# Altium project SDR_LAPAC.PrjPcb (part 4 of 4)

## Sheet AD9364_RF.SchDoc: AD9364_RF
size A3; DrawnBy: Omar_Lopez; Engineer: Omar_Lopez; DocumentNumber: 6; SheetNumber: 6; SheetTotal: 7; PageSetup: Record=PageOptions|CenterHorizontal=True|CenterVertical=True|PrintScale=0.51|XCorrection=1.00|YCorrection=1.00|PrintKind=1|BorderSize=5000000|LeftOffset=0|BottomOffset=0|Orientation=2|PaperLength=1000|PaperWidth=1000|Scale=100|PaperSource=7|PrintQuality=-3|MediaType=1|DitherType=10|PrintScaleMode=1|PaperKind=A3|PaperIndex=8; ModifiedDate: 17/08/2018
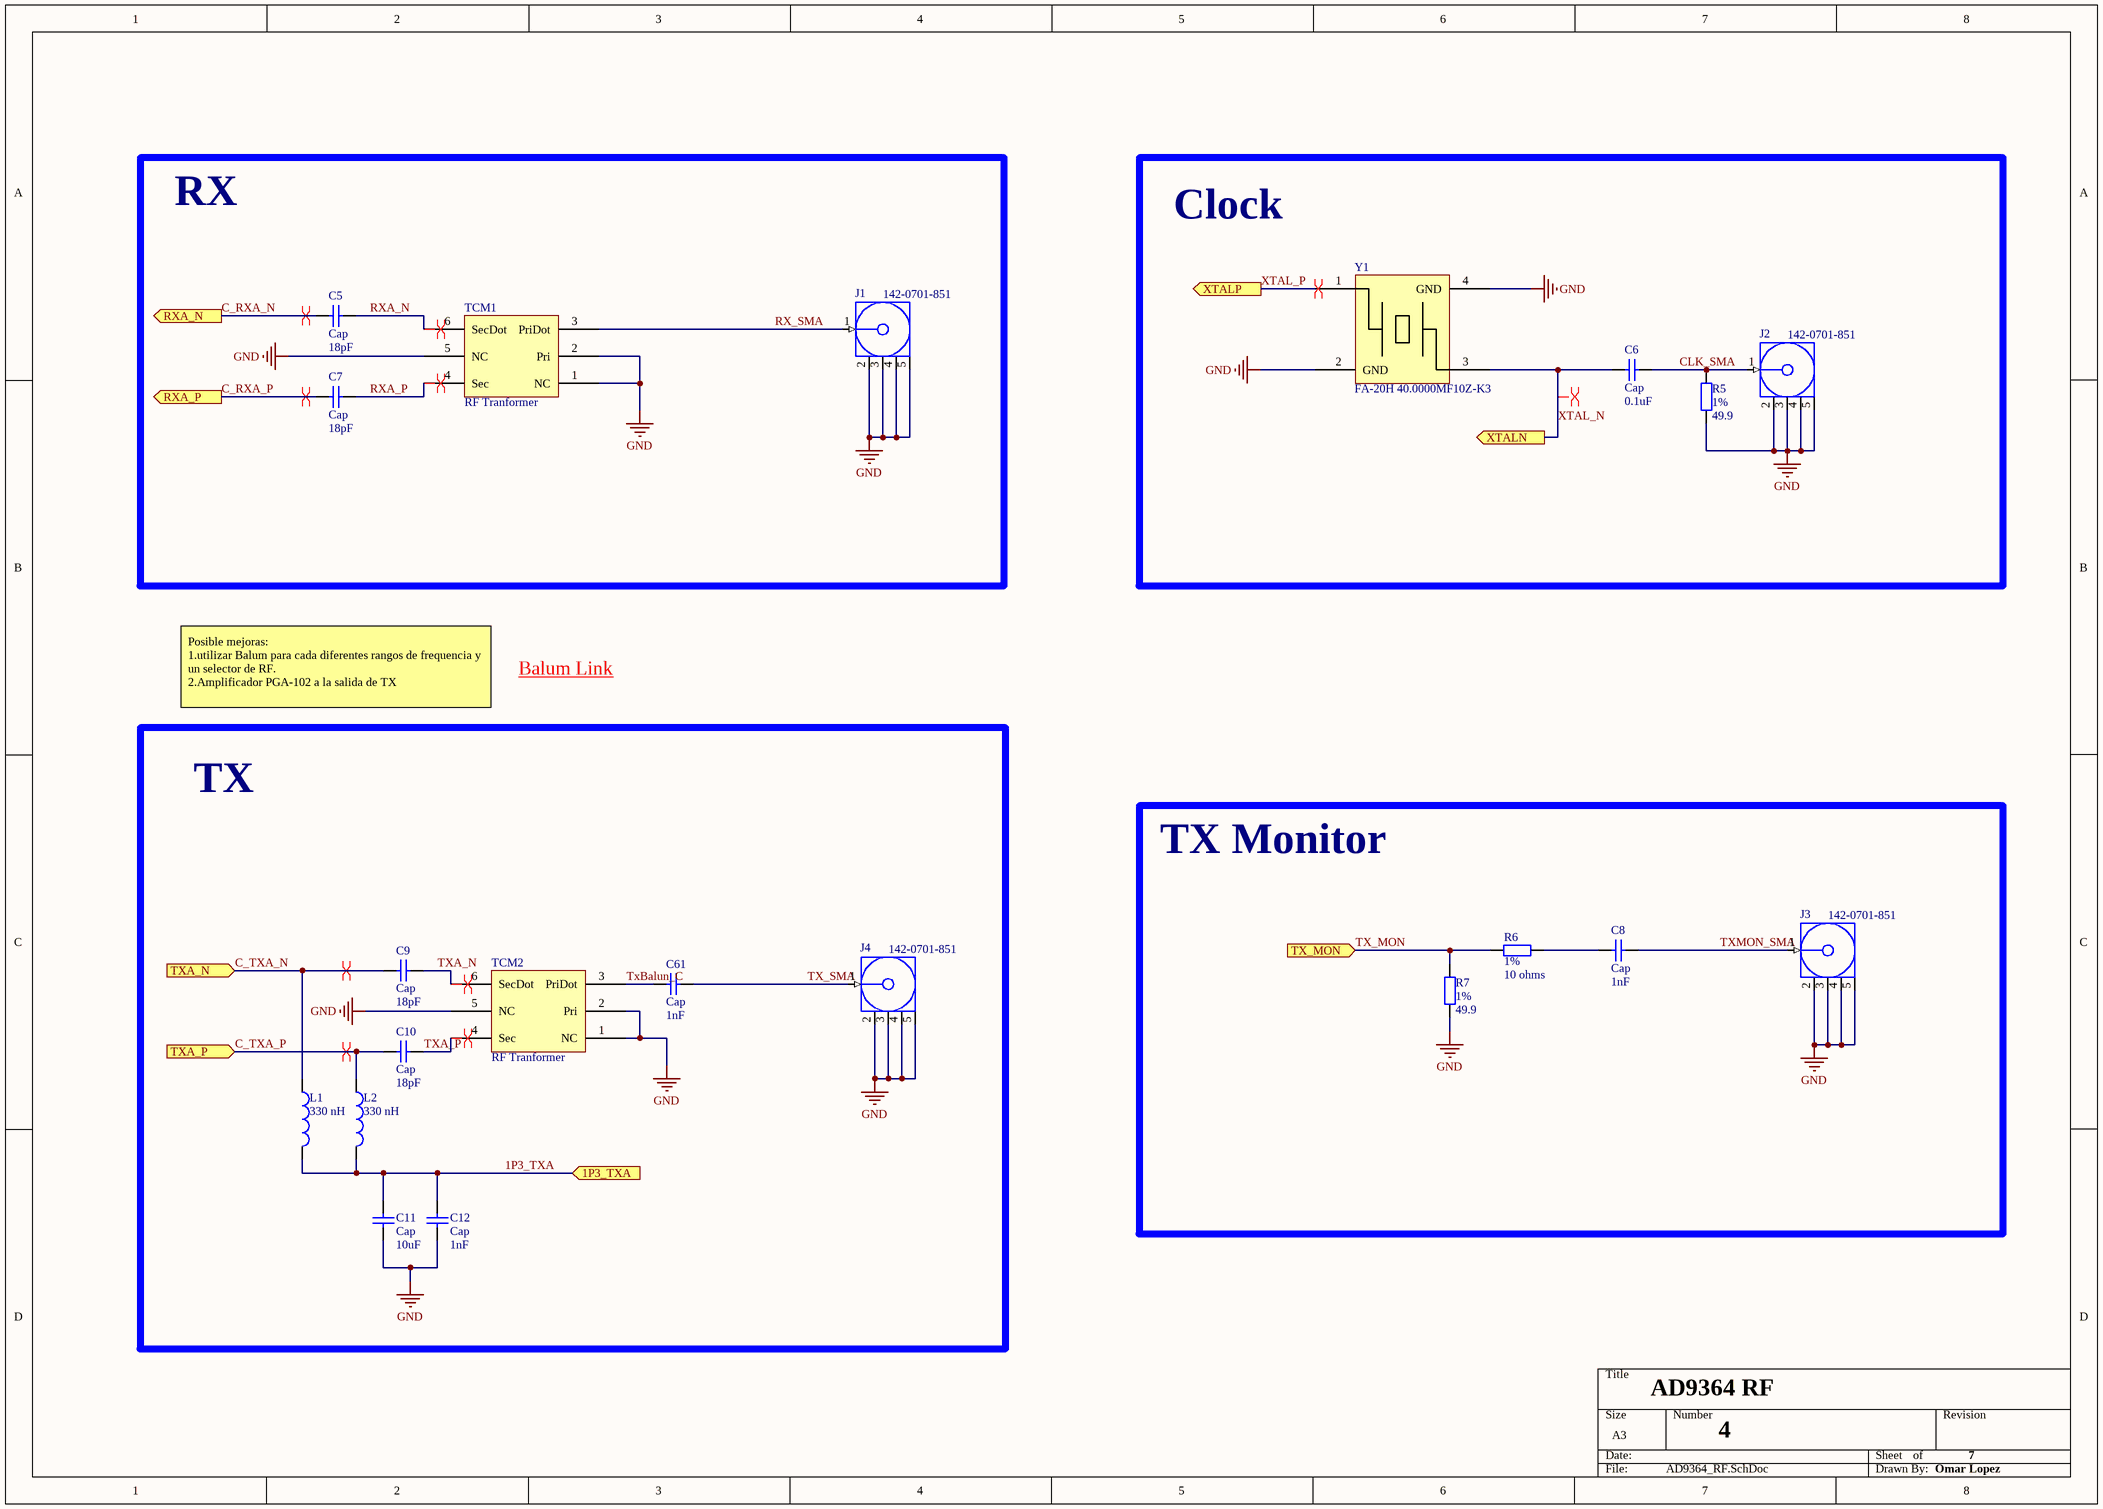
[diagram p20: AD9364_RF.SchDoc]

### Parts
(Parts that share a designator on the sheet are numbered #1, #2 ... from top to bottom, then left to right.)
C5  Cap  value 18pF  [GRM0402MurataCap]
C6  Cap  value 0.1uF  [GRM0603MurataCap]
C7  Cap  value 18pF  [GRM0402MurataCap]
C8  Cap  value 1nF  [GRM0402MurataCap]
C9  Cap  value 18pF  [GRM0402MurataCap]
C10  Cap  value 18pF  [GRM0402MurataCap]
C11  Cap  value 10uF  [GRM0603MurataCap]
C12  Cap  value 1nF  [GRM0402MurataCap]
C61#1  Cap  value 1nF  [GRM0402MurataCap]
J1  142-0701-851  [J502-ND-142-0701-851/861]
J2  142-0701-851  [J502-ND-142-0701-851/861]
J3  142-0701-851  [J502-ND-142-0701-851/861]
J4  142-0701-851  [J502-ND-142-0701-851/861]
L1  value 330 nH  [B82498F3331J]  (hidden comment: B82498F3331J)
L2  value 330 nH  [B82498F3331J]  (hidden comment: B82498F3331J)
R5  1%  value 49.9  [RC0402N]
R6  1%  value 10 ohms  [RC0402N]
R7  1%  value 49.9  [RC0402N]
TCM1  RF Tranformer  [TCM]
TCM2  RF Tranformer  [TCM]
Y1  FA-20H 40.0000MF10Z-K3  [FA-20H]

### Blocks framed on the sheet
RX: C5 C7 J1 TCM1
Clock: C6 J2 R5 Y1
TX: C9-C12 C61#1 J4 L1 L2 TCM2
TX Monitor: C8 J3 R6 R7

### Ports
1P3_TXA (in), RXA_N (out), RXA_P (out), TX_MON (in), TXA_N (in), TXA_P (in), XTALN (out), XTALP (out)

### Nets
GND: C11.1 C12.2 J1.2(GND) J1.3(GND) J1.4(GND) J1.5(GND) J2.2(GND) J2.3(GND) J2.4(GND) J2.5(GND) J3.2(GND) J3.3(GND) J3.4(GND) J3.5(GND) J4.2(GND) J4.3(GND) J4.4(GND) J4.5(GND) R5.1 R7.1 TCM1.1(NC) TCM1.2(Pri) TCM1.5(NC) TCM2.1(NC) TCM2.2(Pri) TCM2.5(NC) Y1.2(GND) Y1.4(GND)
1P3_TXA: C11.2 C12.1 L1.2 L2.2 ; port 1P3_TXA  [project net 1.3V_B]
C_RXA_N: C5.2 ; port RXA_N
C_RXA_P: C7.2 ; port RXA_P
C_TXA_N: C9.2 L1.1 ; port TXA_N
C_TXA_P: C10.2 L2.1 ; port TXA_P
CLK_SMA: C6.2 J2.1(Signal) R5.2
RX_SMA: J1.1(Signal) TCM1.3(PriDot)
RXA_N: C5.1 TCM1.6(SecDot)
RXA_P: C7.1 TCM1.4(Sec)
TX_MON: R6.2 R7.2 ; port TX_MON
TX_SMA: C61#1.2 J4.1(Signal)
TXA_N: C9.1 TCM2.6(SecDot)
TXA_P: C10.1 TCM2.4(Sec)
TxBalun_C: C61#1.1 TCM2.3(PriDot)
TXMON_SMA: C8.2 J3.1(Signal)
XTAL_N: C6.1 Y1.3 ; port XTALN
XTAL_P: Y1.1 ; port XTALP
NetC8_1: C8.1 R6.1

### Layout directives
differential pair; net class RF_Diff100: C_RXA_N, C_RXA_P, C_TXA_N, C_TXA_P, RXA_N, RXA_P, TXA_N, TXA_P, XTAL_N, XTAL_P

### Notes on the sheet
- Posible mejoras:
  1.utilizar Balum para cada diferentes rangos de frequencia y un selector de RF.
  2.Amplificador PGA-102 a la salida de TX
- Balum Link <https://wiki.analog.com/resources/eval/user-guides/ad-fmcomms2-ebz/hardware/configuration_options>
- AD9364 RF
- 4
- 7
- Omar Lopez

### Library data of the parts
C5 C7 C9 C10 = Cap: Capacitor; Manufacturer: Murata; PartNumber: GJM0225C1C180JB01L; Tolerance: 5%; Descripción: Capacitores cerámicos de capas múltiples (MLCC) - SMD/SMT 01005 18pF 16volts C0G +/-5%; CostoVendedor1: 0.14; Vendedor1: Mouser; Vendedor2: Digi-Key; Package: 0402; DataSheet: http://www.mouser.com/ds/2/281/c03e-806517.pdf; LinkVendedor1: https://ar.mouser.com/ProductDetail/Murata-Electronics/GJM0225C1C180JB01L?qs=sGAEpiMZZMs0AnBnWHyRQP81ohtk65EYWMl1VXotSbI%3d; Stock1: 68000
C6 = Cap: Capacitor; Manufacturer: Murata; PartNumber: GRM188R71E104JA01D; Tolerance: 5%; Descripción: SMD/SMT 0603 0.1uF 25volts X7R 5%; CostoVendedor2: 0.15; Vendedor1: Mouser; Vendedor2: Digi-Key; Package: 0603; DataSheet: http://www.mouser.com/ds/2/281/c02e-2905.pdf; LinkVendedor2: https://www.digikey.com/product-detail/en/murata-electronics-north-america/GRM188R71E104JA01D/490-9732-2-ND/2612492; Stock2: 30000
C8 C12 C61#1 = Cap: Capacitor; Manufacturer: Murata; PartNumber: GRM1555C1H102FA01D; Tolerance: 10%; Descripción: 50V SMD; CostoVendedor1: 0.25; Vendedor1: Mouser; Vendedor2: Digi-Key; Package: 0402; DataSheet: http://www.mouser.com/ds/2/281/c02e-2905.pdf; LinkVendedor1: https://ar.mouser.com/ProductDetail/Murata-Electronics/GRM1555C1H102FA01D?qs=sGAEpiMZZMs0AnBnWHyRQHS%2f3XE0oMwxlJflngdMc0Y%3d; Stock1: 95000
C11 = Cap: Capacitor; Manufacturer: Murata; PartNumber: GRT188R60G106ME13D; Tolerance: 20%; Descripción: SMD/SMT 1608 25Vdc 10uF X5R 20%; CostoVendedor1: 0.49; Vendedor1: Mouser; Vendedor2: Digi-Key; Package: 0603; DataSheet: http://www.mouser.com/ds/2/281/product-794208.pdf; LinkVendedor1: https://ar.mouser.com/ProductDetail/Murata-Electronics/GRT188R60G106ME13D?qs=sGAEpiMZZMs0AnBnWHyRQKtaB%2fEehnE2FeWHGxzsCN63uIWHwhnbHA%3d%3d; Stock1: 11000
J1 = COAX-F: RF Coaxial PCB Connector, MCX; Thru-Hole, Right-Angle Mount Socket, Blunt Post Terminal, 50 Ohm Impedance; Manufacturer: Johnson / Cinch Connectivity Solutions; Descripción: Conectores RF / Conectores coaxiales PC END MT JCK GLD .062 BOARDS TAB; CostoVendedor1: 5.52; Vendedor1: Mouser; Vendedor2: Digi-Key; DataSheet: https://ar.mouser.com/datasheet/2/643/pi-CCS-JOHN-142-0701-851-1290383.pdf; PartNumber: 142-0701-851; LinkVendedor1: https://ar.mouser.com/ProductDetail/Johnson-Cinch-Connectivity-Solutions/142-0701-851?qs=%2fha2pyFadui1v%252bStuw7JbeUEiJG3TyXX5bGPyZB9EpM%252bWw6GQwzJRg%3d%3d; Stock1: 17000
J2-J4 = COAX-F: RF Coaxial PCB Connector, MCX; Thru-Hole, Right-Angle Mount Socket, Blunt Post Terminal, 50 Ohm Impedance; Vendedor1: Mouser; Vendedor2: Digi-Key
L1 L2 = Inductor: Manufacturer: TDK; Descripción: Inductores fijos 330nH 220mA 5% 2.3x1.7mm SMD; CostoVendedor1: 0.81; Vendedor1: Mouser; Vendedor2: Digi-Key; DataSheet: http://www.mouser.com/ds/2/400/b82498f-596539.pdf; Package: 0805; PartNumber: B82498F3331J; LinkVendedor1: https://ar.mouser.com/ProductDetail/EPCOS-TDK/B82498F3331J?qs=sGAEpiMZZMsg%252by3WlYCkUwkmiFJnoZ0di2L4sEIoqKU%3d; Stock1: 8000
R5 R7 = Res2: Resistor; Manufacturer: Panasonic; PartNumber: ERJ-2RKF49R9X; Descripción: 100mw 50V; CostoVendedor1: 0.021; Vendedor1: Mouser; Vendedor2: Digi-Key; Package: 0402; Tolerance: 1%; DataSheet: http://www.mouser.com/ds/2/315/AOA0000C86-911473.pdf; LinkVendedor1: https://ar.mouser.com/ProductDetail/Panasonic-Industrial-Devices/ERJ-2RKF49R9X?qs=%2fha2pyFadujciewGcSbxYMVpd936K1irgOtSxB%2fFXkKqb8tQ1uQ2Cg%3d%3d; Stock1: 800000
R6 = Res2: Resistor; Manufacturer: Panasonic; PartNumber: ERJ-2RKF10R0X; Descripción: 100mw 50V; CostoVendedor1: 0.021; Vendedor1: Mouser; Vendedor2: Digi-Key; Package: 0402; Tolerance: 1%; DataSheet: http://www.mouser.com/ds/2/315/AOA0000C86-911473.pdf; LinkVendedor1: https://ar.mouser.com/ProductDetail/Panasonic-Industrial-Devices/ERJ-2RKF10R0X?qs=sGAEpiMZZMu61qfTUdNhGzRxdwze5h8Zlk5qBe8JEKw%3d; Stock1: 500000
TCM1 TCM2 = TCM163AX: Manufacturer: Mini-Circuits; PartNumber: TCM1-63AX+; CostoVendedor1: 6.95; DataSheet: https://www.minicircuits.com/WebStore/dashboard.html?model=TCM1-63AX%2B; Descripción: RF Tranformer; LinkVendedor1: https://www.minicircuits.com/WebStore/dashboard.html?model=TCM1-63AX%2B; LinkVendedor2: https://www.minicircuits.com/WebStore/dashboard.html?model=TCM1-63AX%2B; Vendedor1: Mini-Circuits; Vendedor2: Mini-Circuits
  TCM2: CostoVendedor2: 6.95
Y1 = Component_1: Crystal; Manufacturer: Epson; Descripción: Cristales 40MHz 10ppm 10pF -20C +75C; CostoVendedor1: 0.73; Vendedor1: Mouser; Vendedor2: Digi-Key; DataSheet: http://www.mouser.com/ds/2/137/A-20H_en-932938.pdf; PartNumber: FA-20H 40.0000MF10Z-K3; LinkVendedor1: https://ar.mouser.com/ProductDetail/Epson-Timing/FA-20H-400000MF10Z-K3?qs=%2fha2pyFadujuEaJmRI34tlQPzQojZDIPOS1ANIFqpboCpjGmZ0XFoEeTXimjZ5yU; Stock1: 1000

## Sheet Memory.SchDoc
size C; DocumentNumber: 7; SheetNumber: 7
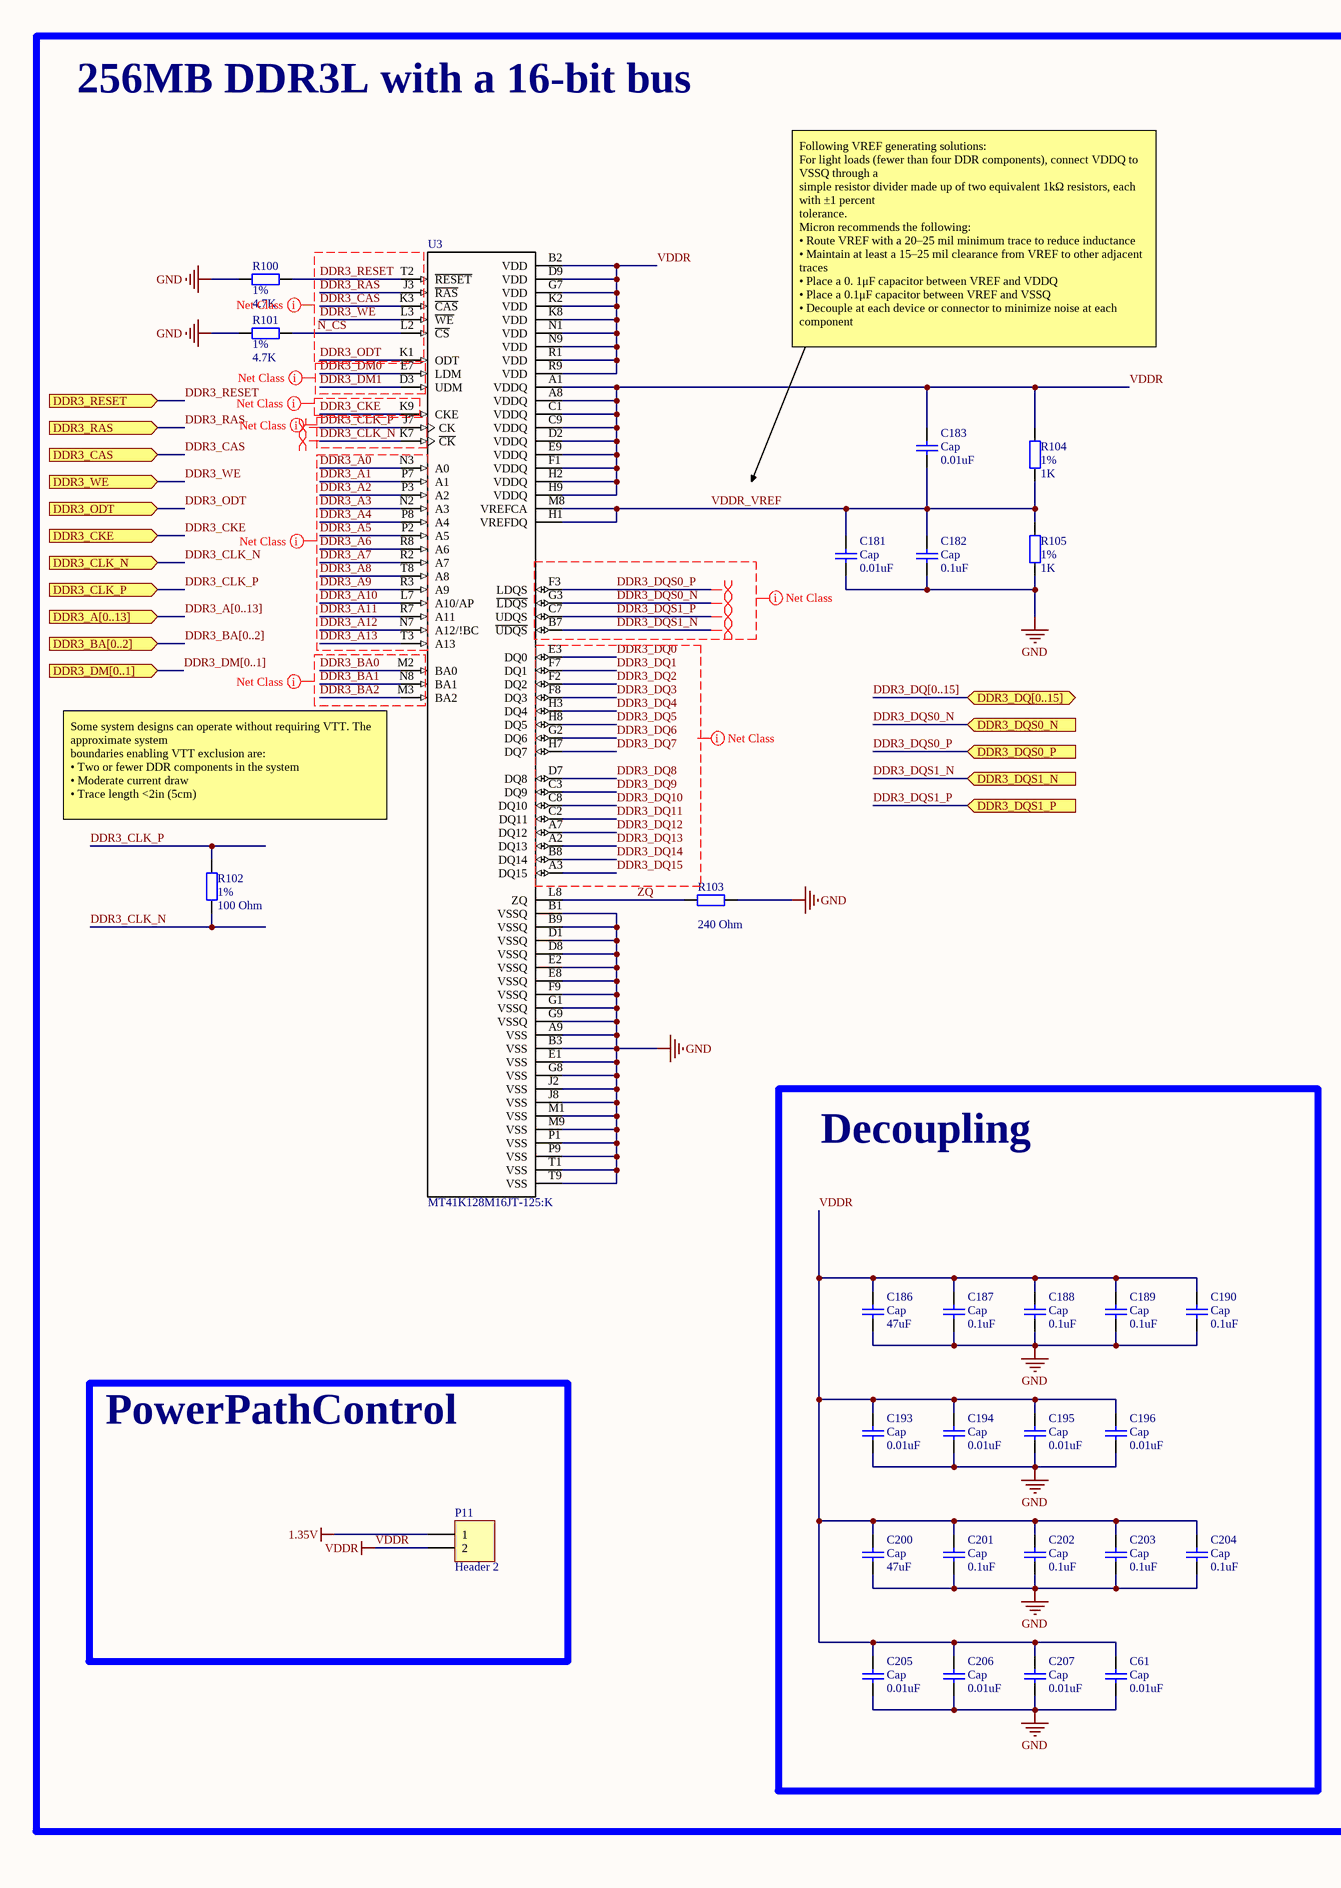
[diagram p21: Memory.SchDoc, left]
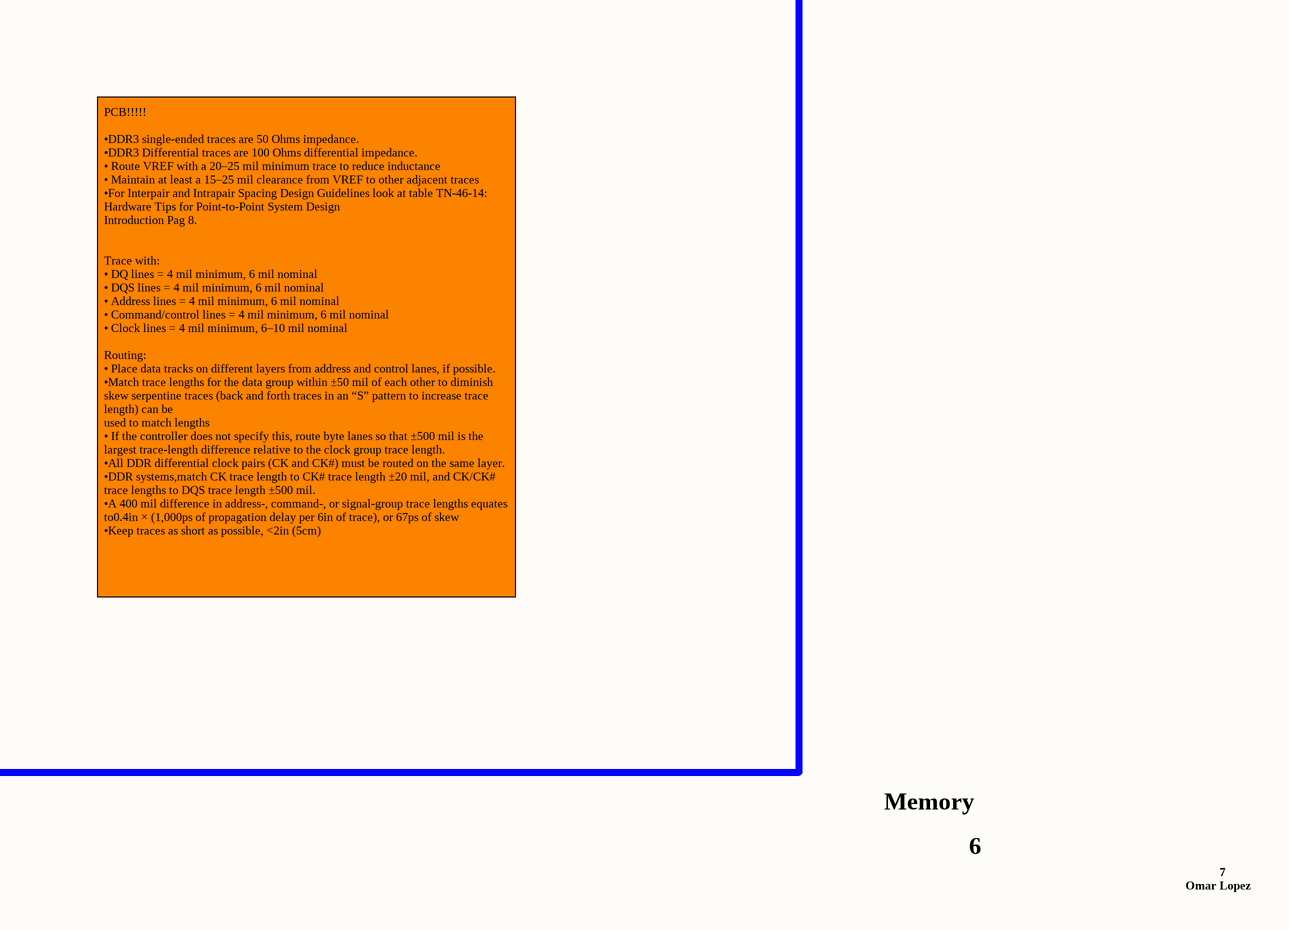
[diagram p22: Memory.SchDoc, right]

### Parts
(Parts that share a designator on the sheet are numbered #1, #2 ... from top to bottom, then left to right.)
C61#2  Cap  value 0.01uF  [GRM0402MurataCap]
C181  Cap  value 0.01uF  [GRM0402MurataCap]
C182  Cap  value 0.1uF  [GRM0402MurataCap]
C183  Cap  value 0.01uF  [GRM0402MurataCap]
C186  Cap  value 47uF  [TaiyoYudenCapMK212]
C187  Cap  value 0.1uF  [GRM0402MurataCap]
C188  Cap  value 0.1uF  [GRM0402MurataCap]
C189  Cap  value 0.1uF  [GRM0402MurataCap]
C190  Cap  value 0.1uF  [GRM0402MurataCap]
C193  Cap  value 0.01uF  [GRM0402MurataCap]
C194  Cap  value 0.01uF  [GRM0402MurataCap]
C195  Cap  value 0.01uF  [GRM0402MurataCap]
C196  Cap  value 0.01uF  [GRM0402MurataCap]
C200  Cap  value 47uF  [TaiyoYudenCapMK212]
C201  Cap  value 0.1uF  [GRM0402MurataCap]
C202  Cap  value 0.1uF  [GRM0402MurataCap]
C203  Cap  value 0.1uF  [GRM0402MurataCap]
C204  Cap  value 0.1uF  [GRM0402MurataCap]
C205  Cap  value 0.01uF  [GRM0402MurataCap]
C206  Cap  value 0.01uF  [GRM0402MurataCap]
C207  Cap  value 0.01uF  [GRM0402MurataCap]
P11  Header 2  [Header2x1]
R100  1%  value 4.7K  [0402Resistor]
R101  1%  value 4.7K  [0402Resistor]
R102  1%  value 100 Ohm  [RC0402N]
R103  value 240 Ohm  [0402Resistor]
R104  1%  value 1K  [RC0402N]
R105  1%  value 1K  [RC0402N]
U3  MT41K128M16JT-125:K  [BGA80P96C6X16_800X1400X110_MT41K128M16JT-125:K(Primary)]

### Blocks framed on the sheet
256MB DDR3L with a 16-bit bus: C181-C183 R100-R105 U3
Decoupling: C61#2 C186-C190 C193-C196 C200-C207
PowerPathControl: P11

### Ports
DDR3_A[0..13] (in), DDR3_BA[0..2] (in), DDR3_CAS (in), DDR3_CKE (in), DDR3_CLK_N (in), DDR3_CLK_P (in), DDR3_DM[0..1] (in), DDR3_DQ[0..15] (bidir), DDR3_DQS0_N (in), DDR3_DQS0_P (in), DDR3_DQS1_N (in), DDR3_DQS1_P (in), DDR3_ODT (in), DDR3_RAS (in), DDR3_RESET (in), DDR3_WE (in)

### Nets
1.35V: P11.1
GND: C61#2.2 C181.2 C182.2 C186.2 C187.2 C188.2 C189.2 C190.2 C193.2 C194.2 C195.2 C196.2 C200.2 C201.2 C202.2 C203.2 C204.2 C205.2 C206.2 C207.2 R100.2 R101.2 R103.2 R105.2 U3.A9(VSS) U3.B1(VSSQ) U3.B3(VSS) U3.B9(VSSQ) U3.D1(VSSQ) U3.D8(VSSQ) U3.E1(VSS) U3.E2(VSSQ) U3.E8(VSSQ) U3.F9(VSSQ) U3.G1(VSSQ) U3.G8(VSS) U3.G9(VSSQ) U3.J2(VSS) U3.J8(VSS) U3.M1(VSS) U3.M9(VSS) U3.P1(VSS) U3.P9(VSS) U3.T1(VSS) U3.T9(VSS)
VDDR: C61#2.1 C183.1 C186.1 C187.1 C188.1 C189.1 C190.1 C193.1 C194.1 C195.1 C196.1 C200.1 C201.1 C202.1 C203.1 C204.1 C205.1 C206.1 C207.1 P11.2 R104.1 U3.A1(VDDQ) U3.A8(VDDQ) U3.B2(VDD) U3.C1(VDDQ) U3.C9(VDDQ) U3.D2(VDDQ) U3.D9(VDD) U3.E9(VDDQ) U3.F1(VDDQ) U3.G7(VDD) U3.H2(VDDQ) U3.H9(VDDQ) U3.K2(VDD) U3.K8(VDD) U3.N1(VDD) U3.N9(VDD) U3.R1(VDD) U3.R9(VDD)
DDR3_A0: U3.N3(A0)
DDR3_A1: U3.P7(A1)
DDR3_A2: U3.P3(A2)
DDR3_A3: U3.N2(A3)
DDR3_A4: U3.P8(A4)
DDR3_A5: U3.P2(A5)
DDR3_A6: U3.R8(A6)
DDR3_A7: U3.R2(A7)
DDR3_A8: U3.T8(A8)
DDR3_A9: U3.R3(A9)
DDR3_A10: U3.L7(A10/AP)
DDR3_A11: U3.R7(A11)
DDR3_A12: U3.N7(A12/!BC)
DDR3_A13: U3.T3(A13)
DDR3_BA0: U3.M2(BA0)
DDR3_BA1: U3.N8(BA1)
DDR3_BA2: U3.M3(BA2)
DDR3_CAS: U3.K3(~{CAS}) ; port DDR3_CAS
DDR3_CKE: U3.K9(CKE) ; port DDR3_CKE
DDR3_CLK_N: R102.1 U3.K7(~{CK}) ; port DDR3_CLK_N  [project net DDR3_CKL_N]
DDR3_CLK_P: R102.2 U3.J7(CK) ; port DDR3_CLK_P  [project net DDR3_CKL_P]
DDR3_DM0: U3.E7(LDM)
DDR3_DM1: U3.D3(UDM)
DDR3_DQ0: U3.E3(DQ0)
DDR3_DQ1: U3.F7(DQ1)
DDR3_DQ2: U3.F2(DQ2)
DDR3_DQ3: U3.F8(DQ3)
DDR3_DQ4: U3.H3(DQ4)
DDR3_DQ5: U3.H8(DQ5)
DDR3_DQ6: U3.G2(DQ6)
DDR3_DQ7: U3.H7(DQ7)
DDR3_DQ8: U3.D7(DQ8)
DDR3_DQ9: U3.C3(DQ9)
DDR3_DQ10: U3.C8(DQ10)
DDR3_DQ11: U3.C2(DQ11)
DDR3_DQ12: U3.A7(DQ12)
DDR3_DQ13: U3.A2(DQ13)
DDR3_DQ14: U3.B8(DQ14)
DDR3_DQ15: U3.A3(DQ15)
DDR3_DQS0_N: U3.G3(~{LDQS}) ; port DDR3_DQS0_N
DDR3_DQS0_P: U3.F3(LDQS) ; port DDR3_DQS0_P
DDR3_DQS1_N: U3.B7(~{UDQS}) ; port DDR3_DQS1_N
DDR3_DQS1_P: U3.C7(UDQS) ; port DDR3_DQS1_P
DDR3_ODT: U3.K1(ODT) ; port DDR3_ODT
DDR3_RAS: U3.J3(~{RAS}) ; port DDR3_RAS
DDR3_RESET: R100.1 U3.T2(~{RESET}) ; port DDR3_RESET
DDR3_WE: U3.L3(~{WE}) ; port DDR3_WE
N_CS: R101.1 U3.L2(~{CS})
VDDR_VREF: C181.1 C182.1 C183.2 R104.2 R105.1 U3.H1(VREFDQ) U3.M8(VREFCA)
ZQ: R103.1 U3.L8(ZQ)

### Buses and harness runs
bus DDR3_A[0..13] = port DDR3_A[0..13]
bus DDR3_BA[0..2] = port DDR3_BA[0..2]
bus DDR3_DM[0..1] = port DDR3_DM[0..1]
bus DDR3_DQ[0..15] = port DDR3_DQ[0..15]

### Layout directives
differential pair; net class DDR3_Diff80: DDR3_DQS0_N, DDR3_DQS0_P, DDR3_DQS1_N, DDR3_DQS1_P
differential pair; net class DDR3_Diff100: DDR3_CKL_N, DDR3_CKL_P
net class DDR3_Data; net class DataGroup: DDR3_DQ0, DDR3_DQ1, DDR3_DQ2, DDR3_DQ3, DDR3_DQ4, DDR3_DQ5, DDR3_DQ6, DDR3_DQ7, DDR3_DQ8, DDR3_DQ9, DDR3_DQ10, DDR3_DQ11, DDR3_DQ12, DDR3_DQ13, DDR3_DQ14, DDR3_DQ15
net class DDR3_DQS; net class DataGroup: DDR3_DQS0_N, DDR3_DQS0_P, DDR3_DQS1_N, DDR3_DQS1_P
net class DDR3_Address; net class AddressGroup: DDR3_A0, DDR3_A1, DDR3_A2, DDR3_A3, DDR3_A4, DDR3_A5, DDR3_A6, DDR3_A7, DDR3_A8, DDR3_A9, DDR3_A10, DDR3_A11, DDR3_A12, DDR3_A13
net class DDR3_BA; net class AddressGroup: DDR3_BA0, DDR3_BA1, DDR3_BA2
net class DDR3_CLK; net class ClockGroup: DDR3_CLK_N, DDR3_CLK_P
net class DDR3_DM; net class DataGroup: DDR3_DM0, DDR3_DM1
net class ControlGroup: DDR3_CAS, DDR3_CKE, DDR3_ODT, DDR3_RAS, DDR3_RESET, DDR3_WE, N_CS

### Notes on the sheet
- Following VREF generating solutions:
  For light loads (fewer than four DDR components), connect VDDQ to VSSQ through a
  simple resistor divider made up of two equivalent 1kΩ resistors, each with ±1 percent
  tolerance.
  Micron recommends the following:
  • Route VREF with a 20–25 mil minimum trace to reduce inductance
  • Maintain at least a 15–25 mil clearance from VREF to other adjacent traces
  • Place a 0. 1μF capacitor between VREF and VDDQ
  • Place a 0.1μF capacitor between VREF and VSSQ
  • Decouple at each device or connector to minimize noise at each component
- Some system designs can operate without requiring VTT. The approximate system
  boundaries enabling VTT exclusion are:
  • Two or fewer DDR components in the system
  • Moderate current draw
  • Trace length <2in (5cm)
- PCB!!!!!
  •DDR3 single-ended traces are 50 Ohms impedance.
  •DDR3 Differential traces are 100 Ohms differential impedance.
  • Route VREF with a 20–25 mil minimum trace to reduce inductance
  • Maintain at least a 15–25 mil clearance from VREF to other adjacent traces
  •For Interpair and Intrapair Spacing Design Guidelines look at table TN-46-14: Hardware Tips for Point-to-Point System Design
  Introduction Pag 8.
  Trace with:
  • DQ lines = 4 mil minimum, 6 mil nominal
  • DQS lines = 4 mil minimum, 6 mil nominal
  • Address lines = 4 mil minimum, 6 mil nominal
  • Command/control lines = 4 mil minimum, 6 mil nominal
  • Clock lines = 4 mil minimum, 6–10 mil nominal
  Routing:
  • Place data tracks on different layers from address and control lanes, if possible.
  •Match trace lengths for the data group within ±50 mil of each other to diminish skew serpentine traces (back and forth traces in an “S” pattern to increase trace length) can be
  used to match lengths
  • If the controller does not specify this, route byte lanes so that ±500 mil is the largest trace-length difference relative to the clock group trace length.
  •All DDR differential clock pairs (CK and CK#) must be routed on the same layer.
  •DDR systems,match CK trace length to CK# trace length ±20 mil, and CK/CK# trace lengths to DQS trace length ±500 mil.
  •A 400 mil difference in address-, command-, or signal-group trace lengths equates to0.4in × (1,000ps of propagation delay per 6in of trace), or 67ps of skew
  •Keep traces as short as possible, <2in (5cm)
- Memory
- 6
- Omar Lopez
- 7

### Library data of the parts
C61#2 C181 C183 C193-C196 C205-C207 = Cap: Capacitor; Manufacturer: Murata; PartNumber: GRM155R71E103KA01D; Tolerance: 10%; Descripción: SMD/SMT 0402 0.01uF 25volts X7R 10%; CostoVendedor1: 0.027; Vendedor1: Mouser; Vendedor2: Digi-Key; Package: 0402; DataSheet: http://www.mouser.com/ds/2/281/c02e-2905.pdf; LinkVendedor1: https://ar.mouser.com/ProductDetail/Murata-Electronics/GRM155R71E103KA01D?utm_term=GRM155R71E103KA01D&qs=tOieHv2smhmMGFtkNVb1ug%3d%3d&utm_campaign=GRM155R71E103KA01D&utm_medium=aggregator&utm_source=findchips&utm_content=Murata
C182 C187-C190 C201-C204 = Cap: Capacitor; Manufacturer: Murata; PartNumber: GRM155R71C104KA88D; Tolerance: 10%; Descripción: 16V  smd; CostoVendedor1: 0.038; Vendedor1: Mouser; Vendedor2: Digi-Key; Package: 0402; DataSheet: http://www.mouser.com/ds/2/281/c02e-2905.pdf
C186 C200 = Cap: Capacitor; Manufacturer: Taiyo Yuden; PartNumber: JMK212BJ476MG-T; Tolerance: 20%; Descripción: Capacitores cerámicos de capas múltiples (MLCC) - SMD/SMT 47uF 6.3V X5R +/-20% 0805 Gen Purp; Vendedor1: Mouser; Vendedor2: Digi-Key; DataSheet: http://www.mouser.com/ds/2/396/mlcc_all_e-541559.pdf
P11 = Header 2: Header, 2-Pin; Vendedor1: Mouser; Vendedor2: Digi-Key
R100 R101 = Res2: Resistor; Manufacturer: Vishay; PartNumber: CRCW04024K70FKED; Descripción: Resistores de película gruesa - SMD 1/16watt 4.7Kohms 1%; Vendedor1: Mouser; Vendedor2: Digi-Key; Package: 0402; Tolerance: 1%; DataSheet: http://www.mouser.com/ds/2/315/AOA0000C104-947597.pdf
R102 = Res2: Resistor; Manufacturer: Panasonic; PartNumber: ERJ-2RKF1000X; Descripción: Anti-Sulfur  100 mW 50V; CostoVendedor1: 0.021; Vendedor1: Mouser; Vendedor2: Digi-Key; Package: 0402; Tolerance: 1%; DataSheet: http://www.mouser.com/ds/2/315/AOA0000C104-947597.pdf; LinkVendedor1: https://ar.mouser.com/ProductDetail/Panasonic/ERJ-2RKF1000X?qs=sGAEpiMZZMu61qfTUdNhGzxKJJelZRhEGST%2FbP4fbIc%3D
R103 = Res2: Resistor; Manufacturer: Vishay; PartNumber: CRCW040240R2FKED; Tolerance: 1%; Descripción: Resistores de película gruesa - SMD 1/16watt 240ohms 1%; Vendedor1: Mouser; Vendedor2: Digi-Key; Package: 0402; DataSheet: http://www.mouser.com/ds/2/315/AOA0000C86-911473.pdf
R104 R105 = Res2: Resistor; Manufacturer: Panasonic; PartNumber: ERJ-2RKF1001X; Descripción: 100mW 50V; Vendedor1: Mouser; Vendedor2: Digi-Key; Tolerance: 1%; DataSheet: http://www.mouser.com/ds/2/315/AOA0000C86-911473.pdf
U3 = MT41K128M16JT-125:K: DRAM Chip DDR3L SDRAM 2G-Bit 128Mx16 1.35V 96-Pin FBGA; Manufacturer: Micron; CostoVendedor2: 10.53; Vendedor1: Mouser; Vendedor2: Digi-Key; Package: TFBGA-96 Micron; Value: *; DataSheet: https://4donline.ihs.com/images/VipMasterIC/IC/MICT/MICT-S-A0002296722/MICT-S-A0002296722-1.pdf; Descripción: DRAM Chip DDR3L SDRAM 2G-Bit 128Mx16 1.35V 96-Pin FBGA; PartNumber: MT41K128M16JT-125:K; LinkVendedor2: https://www.digikey.com/product-detail/en/micron-technology-inc/MT41K128M16JT-125-XIT:K/557-1753-ND/4072478?utm_campaign=buynow&utm_medium=aggregator&WT.z_cid=ref_findchips_standard&utm_source=findchips

## Sheet GPIO.SchDoc
size B; DocumentNumber: 8; SheetNumber: 8
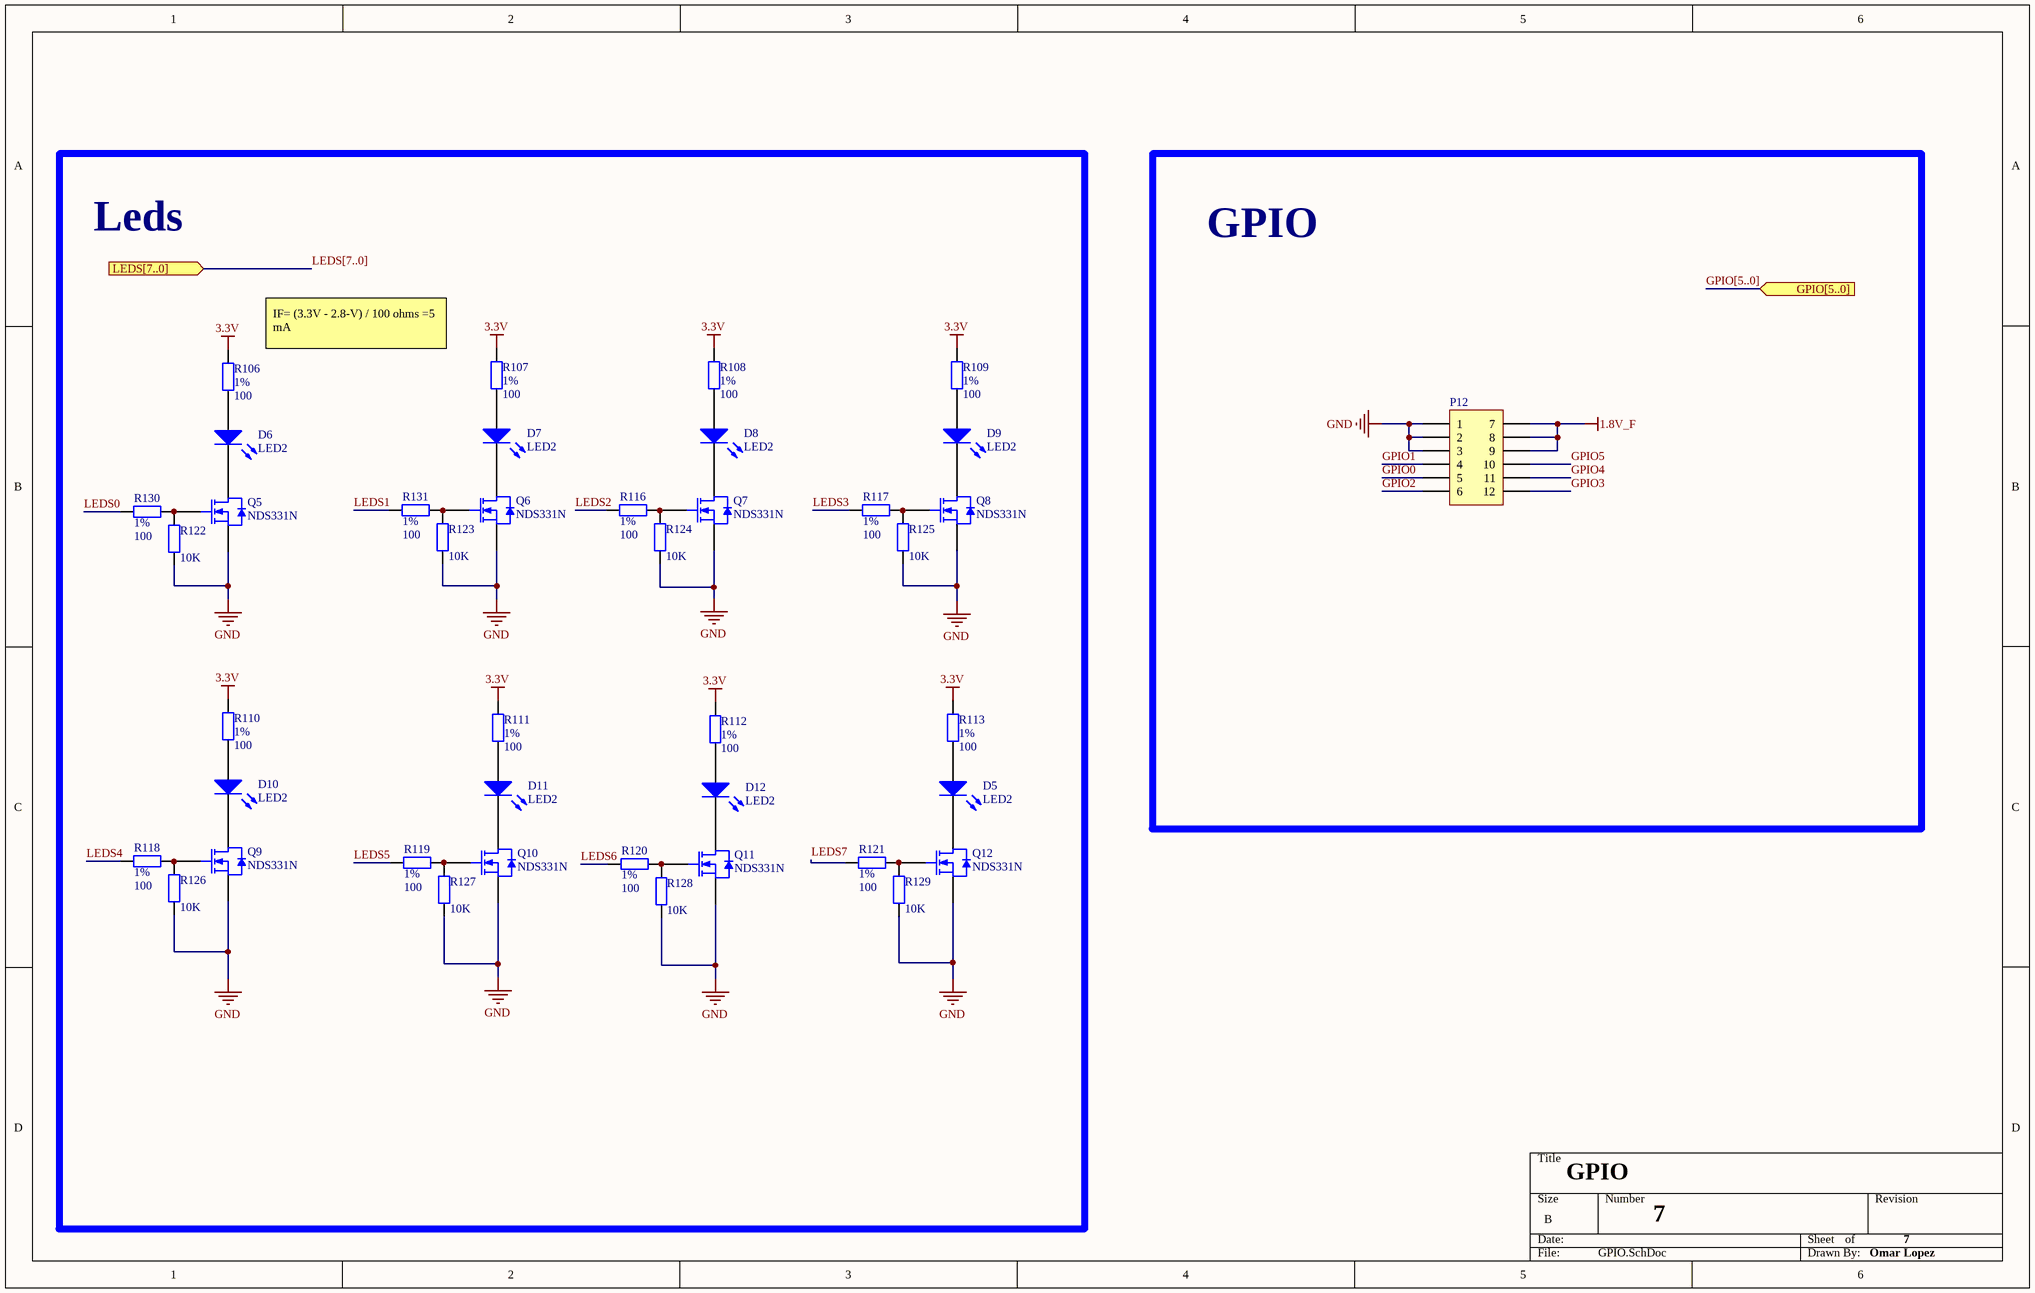
[diagram p23: GPIO.SchDoc]

### Parts
D5  LED2  [LTSTC191]
D6  LED2  [LTSTC191]
D7  LED2  [LTSTC191]
D8  LED2  [LTSTC191]
D9  LED2  [LTSTC191]
D10  LED2  [LTSTC191]
D11  LED2  [LTSTC191]
D12  LED2  [LTSTC191]
P12  (no value)  [PPTC062LJBN-RC]
Q5  NDS331N  [ON_Semi_527AG-01_0]
Q6  NDS331N  [ON_Semi_527AG-01_0]
Q7  NDS331N  [ON_Semi_527AG-01_0]
Q8  NDS331N  [ON_Semi_527AG-01_0]
Q9  NDS331N  [ON_Semi_527AG-01_0]
Q10  NDS331N  [ON_Semi_527AG-01_0]
Q11  NDS331N  [ON_Semi_527AG-01_0]
Q12  NDS331N  [ON_Semi_527AG-01_0]
R106  1%  value 100  [RC0402N]
R107  1%  value 100  [RC0402N]
R108  1%  value 100  [RC0402N]
R109  1%  value 100  [RC0402N]
R110  1%  value 100  [RC0402N]
R111  1%  value 100  [RC0402N]
R112  1%  value 100  [RC0402N]
R113  1%  value 100  [RC0402N]
R116  1%  value 100  [RC0402N]
R117  1%  value 100  [RC0402N]
R118  1%  value 100  [RC0402N]
R119  1%  value 100  [RC0402N]
R120  1%  value 100  [RC0402N]
R121  1%  value 100  [RC0402N]
R122  value 10K  [RC0402N]
R123  value 10K  [RC0402N]
R124  value 10K  [RC0402N]
R125  value 10K  [RC0402N]
R126  value 10K  [RC0402N]
R127  value 10K  [RC0402N]
R128  value 10K  [RC0402N]
R129  value 10K  [RC0402N]
R130  1%  value 100  [RC0402N]
R131  1%  value 100  [RC0402N]

### Blocks framed on the sheet
Leds: D5-D12 Q5-Q12 R106-R113 R116-R131
GPIO: P12

### Ports
GPIO[5..0] (in), LEDS[7..0] (in)

### Nets
1.8V_F: P12.7 P12.8 P12.9
3.3V: R106.2 R107.2 R108.2 R109.2 R110.2 R111.2 R112.2 R113.2
GND: P12.1 P12.2 P12.3 Q5.3(S) Q6.3(S) Q7.3(S) Q8.3(S) Q9.3(S) Q10.3(S) Q11.3(S) Q12.3(S) R122.2 R123.2 R124.2 R125.2 R126.2 R127.2 R128.2 R129.2
GPIO0: P12.5
GPIO1: P12.4
GPIO2: P12.6
GPIO3: P12.12
GPIO4: P12.11
GPIO5: P12.10
LEDS0: R130.2
LEDS1: R131.2
LEDS2: R116.2
LEDS3: R117.2
LEDS4: R118.2
LEDS5: R119.2
LEDS6: R120.2
LEDS7: R121.2
NetD5_1: D5.1(A) R113.1
NetD5_2: D5.2(K) Q12.2(D)
NetD6_1: D6.1(A) R106.1
NetD6_2: D6.2(K) Q5.2(D)
NetD7_1: D7.1(A) R107.1
NetD7_2: D7.2(K) Q6.2(D)
NetD8_1: D8.1(A) R108.1
NetD8_2: D8.2(K) Q7.2(D)
NetD9_1: D9.1(A) R109.1
NetD9_2: D9.2(K) Q8.2(D)
NetD10_1: D10.1(A) R110.1
NetD10_2: D10.2(K) Q9.2(D)
NetD11_1: D11.1(A) R111.1
NetD11_2: D11.2(K) Q10.2(D)
NetD12_1: D12.1(A) R112.1
NetD12_2: D12.2(K) Q11.2(D)
NetQ5_1: Q5.1(G) R122.1 R130.1
NetQ6_1: Q6.1(G) R123.1 R131.1
NetQ7_1: Q7.1(G) R116.1 R124.1
NetQ8_1: Q8.1(G) R117.1 R125.1
NetQ9_1: Q9.1(G) R118.1 R126.1
NetQ10_1: Q10.1(G) R119.1 R127.1
NetQ11_1: Q11.1(G) R120.1 R128.1
NetQ12_1: Q12.1(G) R121.1 R129.1

### Buses and harness runs
bus GPIO[5..0] = port GPIO[5..0]
bus LEDS[7..0] = port LEDS[7..0]

### Notes on the sheet
- IF= (3.3V - 2.8-V) / 100 ohms =5 mA
- GPIO
- 7
- Omar Lopez

### Library data of the parts
D5-D12 = LED2: Typical RED, GREEN, YELLOW, AMBER GaAs LED; Manufacturer: Panasonic; PartNumber: LTST-C193TGKT-5A; Descripción: LED estándar - SMD (montaje superficial) LED RED RECT; CostoVendedor1: 0.28; Vendedor1: Mouser; Vendedor2: Digi-Key; DataSheet: http://www.mouser.com/ds/2/315/LNJ247W82RA_E-947457.pdf; Package: 0603; LinkVendedor1: https://ar.mouser.com/ProductDetail/Lite-On/LTST-C193TGKT-5A?qs=sGAEpiMZZMseGfSY3csMkTQVMbQ3YFstHskAr8LAtWI%3d; Stock1: 29700
P12 = Header 6X2A: Header, 6-Pin, Dual row; Manufacturer: Sullins Connector Solutions; CostoVendedor1: 1.23; Descripción: CONN FEMALE 12POS DL .1" R/A TIN; Vendedor1: Digi-Key; Vendedor2: Mouser; DataSheet: http://sullinscorp.com/drawings/101_P(N)PxCxx2LJBN-RC,_10494-H.pdf; LinkVendedor2: https://www.digikey.com/product-detail/en/sullins-connector-solutions/PPTC062LJBN-RC/S5520-ND/775978; PartNumber: PPTC062LJBN-RC; Stock2: 2290
Q5-Q12 = SUP70N06-14: N-Channel 60V (D-S), 175'C  MOSFET; Manufacturer: On Semiconductor; Descripción: MOSFET N-Ch Digital; CostoVendedor1: 0.35; CostoVendedor2: 0.44; Vendedor1: Mouser; Vendedor2: Digi-Key; DataSheet: https://ar.mouser.com/datasheet/2/308/NDS331N-1125222.pdf; Package: SOT23; PartNumber: NDS331N; LinkVendedor1: https://ar.mouser.com/ProductDetail/ON-Semiconductor-Fairchild/NDS331N?qs=%2Fha2pyFaduhqNlXqKbr%252BjEIU%252BqNoYpa937WlNrMOk8Sienkx2gIkoQ%3D%3D&utm_source=octopart&utm_medium=aggregator&utm_campaign=512-NDS331N&utm_content=ON%20Semiconductor; LinkVendedor2: https://www.digikey.com/product-detail/es/NDS331N/NDS331NCT-ND/458997?utm_campaign=buynow&WT.z_cid=ref_octopart_dkc_buynow&utm_medium=aggregator&curr=usd&site=us&utm_source=octopart; Stock1: 340000; Stock2: 135000
R106-R113 R116-R121 R130 R131 = Res2: Resistor; Manufacturer: Panasonic; PartNumber: ERJ-2RKF4701X; Descripción: Anti-Sulfur  100 mW 50V; CostoVendedor1: 0.021; Vendedor1: Mouser; Vendedor2: Digi-Key; Package: 0402; Tolerance: 1%; DataSheet: http://www.mouser.com/ds/2/315/AOA0000C104-947597.pdf; LinkVendedor1: https://ar.mouser.com/ProductDetail/Panasonic-Industrial-Devices/ERJ-2RKF1000X?qs=sGAEpiMZZMu61qfTUdNhGzxKJJelZRhEGST%2fbP4fbIc%3d; Stock1: 1000000
R122-R129 = Res2: Resistor; Manufacturer: Panasonic; PartNumber: ERJ-2RKF1002X; Tolerance: 1%; Descripción: 100mW 50V; CostoVendedor1: 0.021; Vendedor1: Mouser; Vendedor2: Digi-Key; Package: 0402; DataSheet: http://www.mouser.com/ds/2/315/AOA0000C86-911473.pdf; LinkVendedor1: https://ar.mouser.com/ProductDetail/Panasonic-Industrial-Devices/ERJ-2RKF1002X?qs=%2fha2pyFadujciewGcSbxYCeocmJ1V0ffuiBNpRUU2nm5e2XaRJ685Q%3d%3d; Stock1: 2000000

## Nets that join several sheets
1.2V: USB3.0 (P8.1), Power (5 pins)
1.8V: USB3.0 (P9.1), FPGA (P3.2), Power (5 pins)
1.8V_F: FPGA (60 pins), GPIO (P12.7 P12.8 P12.9)
1.35V: Power (C83.2 C85.2 L6.2 R31.2), Memory (P11.1)
1V: FPGA (P1.2), Power (5 pins)
3.3V: FPGA (R13.2), Power (11 pins), GPIO (8 pins)
GND: AD9364_Interface (77 pins), USB3.0 (74 pins), FPGA (95 pins), Power (91 pins), AD9364_RF (28 pins), Memory (45 pins), GPIO (19 pins)
VBUS: USB3.0 (C180.1 L13.1 U10.E11), Power (Q2.7 Q2.8 U5.1)
VDDR: FPGA (12 pins), Memory (39 pins)
1.3V_A: AD9364_Interface (14 pins), Power (P4.1)
1.3V_B: AD9364_Interface (17 pins), Power (P5.1), AD9364_RF (C11.2 C12.1 L1.2 L2.2)
AD9364_CTRL_IN0: AD9364_Interface (U1.C5), FPGA (U2.J5)
AD9364_CTRL_IN1: AD9364_Interface (U1.C6), FPGA (U2.E3)
AD9364_CTRL_IN2: AD9364_Interface (U1.D6), FPGA (U2.B2)
AD9364_CTRL_IN3: AD9364_Interface (U1.D5), FPGA (U2.B5)
AD9364_CTRL_OUT0: AD9364_Interface (U1.D4), FPGA (U2.A5)
AD9364_CTRL_OUT1: AD9364_Interface (U1.E4), FPGA (U2.B6)
AD9364_CTRL_OUT2: AD9364_Interface (U1.E5), FPGA (U2.D4)
AD9364_CTRL_OUT3: AD9364_Interface (U1.E6), FPGA (U2.C1)
AD9364_CTRL_OUT4: AD9364_Interface (U1.F6), FPGA (U2.A4)
AD9364_CTRL_OUT5: AD9364_Interface (U1.F5), FPGA (U2.C6)
AD9364_CTRL_OUT6: AD9364_Interface (U1.F4), FPGA (U2.F5)
AD9364_CTRL_OUT7: AD9364_Interface (U1.G4), FPGA (U2.B7)
AD9364_P0D0: AD9364_Interface (U1.E12), FPGA (U2.H2)
AD9364_P0D1: AD9364_Interface (U1.D11), FPGA (U2.G1)
AD9364_P0D2: AD9364_Interface (U1.E11), FPGA (U2.H1)
AD9364_P0D3: AD9364_Interface (U1.D10), FPGA (U2.B1)
AD9364_P0D4: AD9364_Interface (U1.E10), FPGA (U2.C3)
AD9364_P0D5: AD9364_Interface (U1.D9), FPGA (U2.G2)
AD9364_P0D6: AD9364_Interface (U1.E9), FPGA (U2.A2)
AD9364_P0D7: AD9364_Interface (U1.D8), FPGA (U2.F2)
AD9364_P0D8: AD9364_Interface (U1.E8), FPGA (U2.E1)
AD9364_P0D9: AD9364_Interface (U1.D7), FPGA (U2.E2)
AD9364_P0D10: AD9364_Interface (U1.F8), FPGA (U2.C2)
AD9364_P0D11: AD9364_Interface (U1.E7), FPGA (U2.A3)
AD9364_P1D0: AD9364_Interface (U1.K11), FPGA (U2.K3)
AD9364_P1D1: AD9364_Interface (U1.J12), FPGA (U2.K2)
AD9364_P1D2: AD9364_Interface (U1.K10), FPGA (U2.H4)
AD9364_P1D3: AD9364_Interface (U1.J11), FPGA (U2.J1)
AD9364_P1D4: AD9364_Interface (U1.K9), FPGA (U2.L2)
AD9364_P1D5: AD9364_Interface (U1.J10), FPGA (U2.K1)
AD9364_P1D6: AD9364_Interface (U1.K8), FPGA (U2.L3)
AD9364_P1D7: AD9364_Interface (U1.J9), FPGA (U2.G4)
AD9364_P1D8: AD9364_Interface (U1.K7), FPGA (U2.H3)
AD9364_P1D9: AD9364_Interface (U1.J8), FPGA (U2.F3)
AD9364_P1D10: AD9364_Interface (U1.J7), FPGA (U2.J3)
AD9364_P1D11: AD9364_Interface (U1.H8), FPGA (U2.B4)
C_RXA_N: AD9364_Interface (U1.M2), AD9364_RF (C5.2)
C_RXA_P: AD9364_Interface (U1.M1), AD9364_RF (C7.2)
C_TXA_N: AD9364_Interface (U1.M8), AD9364_RF (C9.2 L1.1)
C_TXA_P: AD9364_Interface (U1.M7), AD9364_RF (C10.2 L2.1)
CLK_OUT: AD9364_Interface (U1.J6), FPGA (U2.C4)
DATA_CLK: AD9364_Interface (U1.G11), FPGA (U2.E5)
DDR3_A0: FPGA (U2.C14), Memory (U3.N3)
DDR3_A1: FPGA (U2.A14), Memory (U3.P7)
DDR3_A2: FPGA (U2.B11), Memory (U3.P3)
DDR3_A3: FPGA (U2.C12), Memory (U3.N2)
DDR3_A4: FPGA (U2.B14), Memory (U3.P8)
DDR3_A5: FPGA (U2.A13), Memory (U3.P2)
DDR3_A6: FPGA (U2.A12), Memory (U3.R8)
DDR3_A7: FPGA (U2.C9), Memory (U3.R2)
DDR3_A8: FPGA (U2.B12), Memory (U3.T8)
DDR3_A9: FPGA (U2.D9), Memory (U3.R3)
DDR3_A10: FPGA (U2.C13), Memory (U3.L7)
DDR3_A11: FPGA (U2.B10), Memory (U3.R7)
DDR3_A12: FPGA (U2.B15), Memory (U3.N7)
DDR3_A13: FPGA (U2.A9), Memory (U3.T3)
DDR3_BA0: FPGA (U2.D13), Memory (U3.M2)
DDR3_BA1: FPGA (U2.A15), Memory (U3.N8)
DDR3_BA2: FPGA (U2.C16), Memory (U3.M3)
DDR3_CAS: FPGA (U2.C8), Memory (U3.K3)
DDR3_CKE: FPGA (U2.B16), Memory (U3.K9)
DDR3_CKL_N: FPGA (U2.A10), Memory (R102.1 U3.K7)
DDR3_CKL_P: FPGA (U2.B9), Memory (R102.2 U3.J7)
DDR3_DM0: FPGA (U2.E15), Memory (U3.E7)
DDR3_DM1: FPGA (U2.H13), Memory (U3.D3)
DDR3_DQ0: FPGA (U2.D16), Memory (U3.E3)
DDR3_DQ1: FPGA (U2.E16), Memory (U3.F7)
DDR3_DQ2: FPGA (U2.E12), Memory (U3.F2)
DDR3_DQ3: FPGA (U2.F13), Memory (U3.F8)
DDR3_DQ4: FPGA (U2.E11), Memory (U3.H3)
DDR3_DQ5: FPGA (U2.E13), Memory (U3.H8)
DDR3_DQ6: FPGA (U2.D11), Memory (U3.G2)
DDR3_DQ7: FPGA (U2.F12), Memory (U3.H7)
DDR3_DQ8: FPGA (U2.H16), Memory (U3.D7)
DDR3_DQ9: FPGA (U2.H12), Memory (U3.C3)
DDR3_DQ10: FPGA (U2.H14), Memory (U3.C8)
DDR3_DQ11: FPGA (U2.J16), Memory (U3.C2)
DDR3_DQ12: FPGA (U2.G16), Memory (U3.A7)
DDR3_DQ13: FPGA (U2.J15), Memory (U3.A2)
DDR3_DQ14: FPGA (U2.G12), Memory (U3.B8)
DDR3_DQ15: FPGA (U2.H11), Memory (U3.A3)
DDR3_DQS0_N: FPGA (U2.D15), Memory (U3.G3)
DDR3_DQS0_P: FPGA (U2.D14), Memory (U3.F3)
DDR3_DQS1_N: FPGA (U2.F14), Memory (U3.B7)
DDR3_DQS1_P: FPGA (U2.G14), Memory (U3.C7)
DDR3_ODT: FPGA (U2.C11), Memory (U3.K1)
DDR3_RAS: FPGA (U2.D8), Memory (U3.J3)
DDR3_RESET: FPGA (U2.D10), Memory (R100.1 U3.T2)
DDR3_WE: FPGA (U2.A8), Memory (U3.L3)
EN_AGC: AD9364_Interface (U1.G5), FPGA (U2.C7)
ENABLE_AD9364: AD9364_Interface (U1.G6), FPGA (U2.D5)
F_CTL0: USB3.0 (R62.1), FPGA (U2.P4)
F_CTL1: USB3.0 (R63.1), FPGA (U2.T5)
F_CTL2: USB3.0 (R64.1), FPGA (U2.T4)
F_CTL3: USB3.0 (R65.1), FPGA (U2.R5)
F_CTL4: USB3.0 (R66.1), FPGA (U2.T7)
F_CTL5: USB3.0 (R69.1), FPGA (U2.R7)
F_CTL6: USB3.0 (R73.1), FPGA (U2.T9)
F_CTL7: USB3.0 (R74.1), FPGA (U2.R3)
F_CTL8: USB3.0 (R75.1), FPGA (U2.R8)
F_CTL9: USB3.0 (R76.1), FPGA (U2.P5)
F_CTL10: USB3.0 (R77.1), FPGA (U2.N6)
F_CTL11: USB3.0 (R78.1), FPGA (U2.T10)
F_CTL12: USB3.0 (R79.1), FPGA (U2.R11)
F_DQ0: USB3.0 (R44.1), FPGA (U2.N1)
F_DQ1: USB3.0 (R45.1), FPGA (U2.R1)
F_DQ2: USB3.0 (R46.1), FPGA (U2.T8)
F_DQ3: USB3.0 (R47.1), FPGA (U2.M1)
F_DQ4: USB3.0 (R48.1), FPGA (U2.R2)
F_DQ5: USB3.0 (R50.1), FPGA (U2.T2)
F_DQ6: USB3.0 (R51.1), FPGA (U2.P1)
F_DQ7: USB3.0 (R52.1), FPGA (U2.T3)
F_DQ8: USB3.0 (R53.1), FPGA (U2.M2)
F_DQ9: USB3.0 (R54.1), FPGA (U2.M4)
F_DQ10: USB3.0 (R55.1), FPGA (U2.N4)
F_DQ11: USB3.0 (R56.1), FPGA (U2.L5)
F_DQ12: USB3.0 (R57.1), FPGA (U2.N2)
F_DQ13: USB3.0 (R58.1), FPGA (U2.M5)
F_DQ14: USB3.0 (R59.1), FPGA (U2.P6)
F_DQ15: USB3.0 (R60.1), FPGA (U2.R6)
F_DQ16: USB3.0 (R81.1), FPGA (U2.N9)
F_DQ17: USB3.0 (R82.1), FPGA (U2.P8)
F_DQ18: USB3.0 (R83.1), FPGA (U2.P9)
F_DQ19: USB3.0 (R84.1), FPGA (U2.M6)
F_DQ20: USB3.0 (R85.1), FPGA (U2.T13)
F_DQ21: USB3.0 (R86.1), FPGA (U2.P10)
F_DQ22: USB3.0 (R87.1), FPGA (U2.T12)
F_DQ23: USB3.0 (R88.1), FPGA (U2.N13)
F_DQ24: USB3.0 (R89.1), FPGA (U2.P13)
F_DQ25: USB3.0 (R90.1), FPGA (U2.P16)
F_DQ26: USB3.0 (R91.1), FPGA (U2.P15)
F_DQ27: USB3.0 (R92.1), FPGA (U2.T14)
F_DQ28: USB3.0 (R93.1), FPGA (U2.R13)
F_DQ29: USB3.0 (R94.1), FPGA (U2.R16)
F_DQ30: USB3.0 (R95.1), FPGA (U2.T15)
F_DQ31: USB3.0 (R96.1), FPGA (U2.R15)
F_FB_CLK: AD9364_Interface (U1.F10), FPGA (U2.D1)
F_INT_CTL: USB3.0 (U10.L8), FPGA (U2.L4)
F_PCLK: USB3.0 (R61.1), FPGA (U2.N11)
F_RX_FRAME: AD9364_Interface (U1.G8), FPGA (U2.D3)
F_TX_FRAME: AD9364_Interface (U1.G9), FPGA (U2.J4)
FPGA_CCLK: USB3.0 (U10.D4), FPGA (U2.E8)
FPGA_DONE: USB3.0 (U10.D1), FPGA (Q4.1 U2.H10)
FPGA_PROGRA_B: USB3.0 (U10.C1), FPGA (R9.1 S1.1 S1.2 U2.L9)
FPGA_SPI_MISO: USB3.0 (U10.D5), FPGA (U2.J14)
FPGA_SPI_MOSI: USB3.0 (U10.C2), FPGA (U2.J13)
FX3_GPIO52: USB3.0 (U10.D3), FPGA (R11.1 U2.K10)
GPIO0: FPGA (U2.K15), GPIO (P12.5)
GPIO1: FPGA (U2.M16), GPIO (P12.4)
GPIO2: FPGA (U2.K13), GPIO (P12.6)
GPIO3: FPGA (U2.K12), GPIO (P12.12)
GPIO4: FPGA (U2.N14), GPIO (P12.11)
GPIO5: FPGA (U2.R12), GPIO (P12.10)
LEDS0: FPGA (U2.K16), GPIO (R130.2)
LEDS1: FPGA (U2.M14), GPIO (R131.2)
LEDS2: FPGA (U2.L14), GPIO (R116.2)
LEDS3: FPGA (U2.N16), GPIO (R117.2)
LEDS4: FPGA (U2.L13), GPIO (R118.2)
LEDS5: FPGA (U2.K5), GPIO (R119.2)
LEDS6: FPGA (U2.N3), GPIO (R120.2)
LEDS7: FPGA (U2.P3), GPIO (R121.2)
SPI_CLK: AD9364_Interface (U1.J5), FPGA (U2.A7)
SPI_DI: AD9364_Interface (U1.J4), FPGA (U2.F4)
SPI_DO: AD9364_Interface (U1.L6), FPGA (U2.H5)
SPI_EN: AD9364_Interface (U1.K6), FPGA (U2.G5)
SYNC_IN_F: AD9364_Interface (U1.H5), FPGA (U2.D6)
TX_MON: AD9364_Interface (U1.M5), AD9364_RF (R6.2 R7.2)
TXNRX: AD9364_Interface (U1.H4), FPGA (U2.E6)
VDD_INTERFACE: AD9364_Interface (6 pins), Power (P6.2)
VDDA_GPO: AD9364_Interface (5 pins), Power (P7.2)
XTAL_N: AD9364_Interface (U1.M12), AD9364_RF (C6.1 Y1.3)
XTAL_P: AD9364_Interface (U1.M11), AD9364_RF (Y1.1)